# Altium schematic sheet 22_LMS2_TX_BB_DACs.SchDoc: LMS2 TX BB DACs
size A3; Organization: Lime Microsystems; Address1: Surrey Tech Centre; Address2: Guildford GU2 7YG; Address3: Surrey; Address4: United Kingdom; Revision: v1.1; SheetNumber: 22; SheetTotal: 31
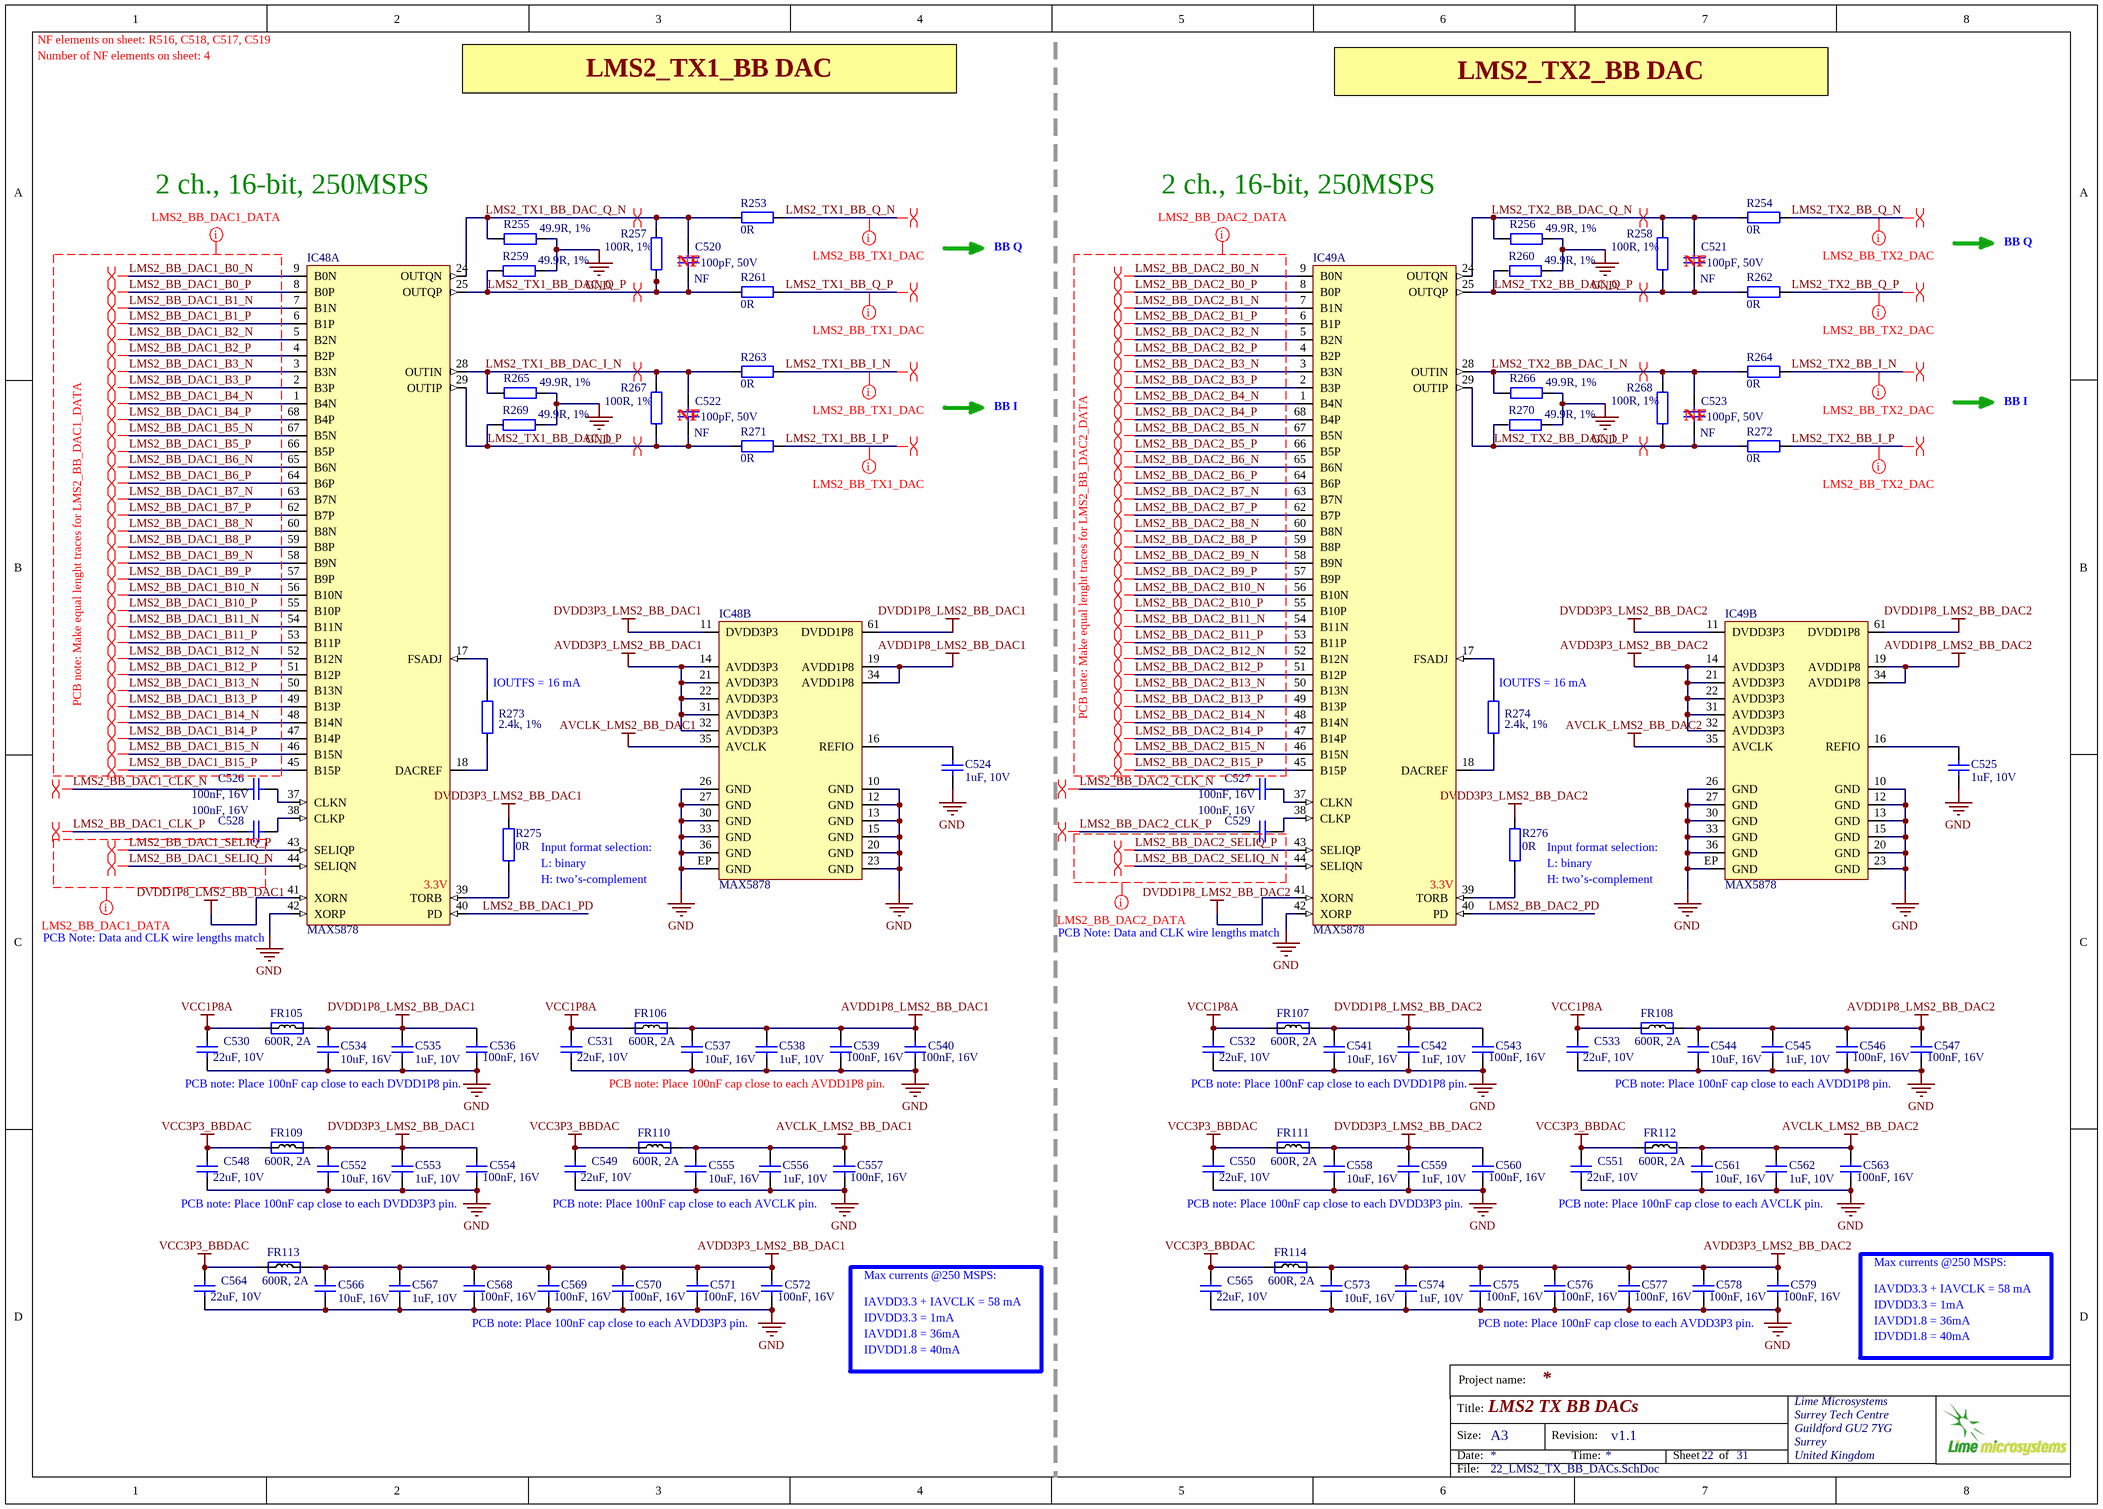
[diagram p0: 22_LMS2_TX_BB_DACs.SchDoc]

## Parts
C520  100pF, 50V  Assembly Info: NF  [CAP0402]
C521  100pF, 50V  Assembly Info: NF  [CAP0402]
C522  100pF, 50V  Assembly Info: NF  [CAP0402]
C523  100pF, 50V  Assembly Info: NF  [CAP0402]
C524  1uF, 10V  [CAP0402]
C525  1uF, 10V  [CAP0402]
C526  100nF, 16V  [CAP0402]
C527  100nF, 16V  [CAP0402]
C528  100nF, 16V  [CAP0402]
C529  100nF, 16V  [CAP0402]
C530  22uF, 10V  [CAP0603]
C531  22uF, 10V  [CAP0603]
C532  22uF, 10V  [CAP0603]
C533  22uF, 10V  [CAP0603]
C534  10uF, 16V  [CAP0603]
C535  1uF, 10V  [CAP0402]
C536  100nF, 16V  [CAP0402]
C537  10uF, 16V  [CAP0603]
C538  1uF, 10V  [CAP0402]
C539  100nF, 16V  [CAP0402]
C540  100nF, 16V  [CAP0402]
C541  10uF, 16V  [CAP0603]
C542  1uF, 10V  [CAP0402]
C543  100nF, 16V  [CAP0402]
C544  10uF, 16V  [CAP0603]
C545  1uF, 10V  [CAP0402]
C546  100nF, 16V  [CAP0402]
C547  100nF, 16V  [CAP0402]
C548  22uF, 10V  [CAP0603]
C549  22uF, 10V  [CAP0603]
C550  22uF, 10V  [CAP0603]
C551  22uF, 10V  [CAP0603]
C552  10uF, 16V  [CAP0603]
C553  1uF, 10V  [CAP0402]
C554  100nF, 16V  [CAP0402]
C555  10uF, 16V  [CAP0603]
C556  1uF, 10V  [CAP0402]
C557  100nF, 16V  [CAP0402]
C558  10uF, 16V  [CAP0603]
C559  1uF, 10V  [CAP0402]
C560  100nF, 16V  [CAP0402]
C561  10uF, 16V  [CAP0603]
C562  1uF, 10V  [CAP0402]
C563  100nF, 16V  [CAP0402]
C564  22uF, 10V  [CAP0603]
C565  22uF, 10V  [CAP0603]
C566  10uF, 16V  [CAP0603]
C567  1uF, 10V  [CAP0402]
C568  100nF, 16V  [CAP0402]
C569  100nF, 16V  [CAP0402]
C570  100nF, 16V  [CAP0402]
C571  100nF, 16V  [CAP0402]
C572  100nF, 16V  [CAP0402]
C573  10uF, 16V  [CAP0603]
C574  1uF, 10V  [CAP0402]
C575  100nF, 16V  [CAP0402]
C576  100nF, 16V  [CAP0402]
C577  100nF, 16V  [CAP0402]
C578  100nF, 16V  [CAP0402]
C579  100nF, 16V  [CAP0402]
FR105  600R, 2A  [RES0805]
FR106  600R, 2A  [RES0805]
FR107  600R, 2A  [RES0805]
FR108  600R, 2A  [RES0805]
FR109  600R, 2A  [RES0805]
FR110  600R, 2A  [RES0805]
FR111  600R, 2A  [RES0805]
FR112  600R, 2A  [RES0805]
FR113  600R, 2A  [RES0805]
FR114  600R, 2A  [RES0805]
IC48  MAX5878  [MAX5878_QFN68]  (parts A,B of 2)
IC49  MAX5878  [MAX5878_QFN68]  (parts A,B of 2)
R253  0R  [RES0402]
R254  0R  [RES0402]
R255  49.9R, 1%  [RES0402]
R256  49.9R, 1%  [RES0402]
R257  100R, 1%  [RES0402]
R258  100R, 1%  [RES0402]
R259  49.9R, 1%  [RES0402]
R260  49.9R, 1%  [RES0402]
R261  0R  [RES0402]
R262  0R  [RES0402]
R263  0R  [RES0402]
R264  0R  [RES0402]
R265  49.9R, 1%  [RES0402]
R266  49.9R, 1%  [RES0402]
R267  100R, 1%  [RES0402]
R268  100R, 1%  [RES0402]
R269  49.9R, 1%  [RES0402]
R270  49.9R, 1%  [RES0402]
R271  0R  [RES0402]
R272  0R  [RES0402]
R273  2.4k, 1%  [RES0402]
R274  2.4k, 1%  [RES0402]
R275  0R  [RES0402]
R276  0R  [RES0402]

## Nets
AVCLK_LMS2_BB_DAC1: C555.2 C556.2 C557.2 FR110.2 IC48.35(AVCLK)
AVCLK_LMS2_BB_DAC2: C561.2 C562.2 C563.2 FR112.2 IC49.35(AVCLK)
AVDD1P8_LMS2_BB_DAC1: C537.2 C538.2 C539.2 C540.2 FR106.2 IC48.19(AVDD1P8) IC48.34(AVDD1P8)
AVDD1P8_LMS2_BB_DAC2: C544.2 C545.2 C546.2 C547.2 FR108.2 IC49.19(AVDD1P8) IC49.34(AVDD1P8)
AVDD3P3_LMS2_BB_DAC1: C566.2 C567.2 C568.2 C569.2 C570.2 C571.2 C572.2 FR113.2 IC48.14(AVDD3P3) IC48.21(AVDD3P3) IC48.22(AVDD3P3) IC48.31(AVDD3P3) IC48.32(AVDD3P3)
AVDD3P3_LMS2_BB_DAC2: C573.2 C574.2 C575.2 C576.2 C577.2 C578.2 C579.2 FR114.2 IC49.14(AVDD3P3) IC49.21(AVDD3P3) IC49.22(AVDD3P3) IC49.31(AVDD3P3) IC49.32(AVDD3P3)
DVDD1P8_LMS2_BB_DAC1: C534.2 C535.2 C536.2 FR105.2 IC48.41(XORN) IC48.61(DVDD1P8)
DVDD1P8_LMS2_BB_DAC2: C541.2 C542.2 C543.2 FR107.2 IC49.41(XORN) IC49.61(DVDD1P8)
DVDD3P3_LMS2_BB_DAC1: C552.2 C553.2 C554.2 FR109.2 IC48.11(DVDD3P3) R275.2
DVDD3P3_LMS2_BB_DAC2: C558.2 C559.2 C560.2 FR111.2 IC49.11(DVDD3P3) R276.2
GND: C524.1 C525.1 C530.1 C531.1 C532.1 C533.1 C534.1 C535.1 C536.1 C537.1 C538.1 C539.1 C540.1 C541.1 C542.1 C543.1 C544.1 C545.1 C546.1 C547.1 C548.1 C549.1 C550.1 C551.1 C552.1 C553.1 C554.1 C555.1 C556.1 C557.1 C558.1 C559.1 C560.1 C561.1 C562.1 C563.1 C564.1 C565.1 C566.1 C567.1 C568.1 C569.1 C570.1 C571.1 C572.1 C573.1 C574.1 C575.1 C576.1 C577.1 C578.1 C579.1 IC48.10(GND) IC48.12(GND) IC48.13(GND) IC48.15(GND) IC48.20(GND) IC48.23(GND) IC48.26(GND) IC48.27(GND) IC48.30(GND) IC48.33(GND) IC48.36(GND) IC48.42(XORP) IC48.EP(GND) IC49.10(GND) IC49.12(GND) IC49.13(GND) IC49.15(GND) IC49.20(GND) IC49.23(GND) IC49.26(GND) IC49.27(GND) IC49.30(GND) IC49.33(GND) IC49.36(GND) IC49.42(XORP) IC49.EP(GND) R255.1 R256.1 R259.1 R260.1 R265.1 R266.1 R269.1 R270.1
VCC1P8A: C530.2 C531.2 C532.2 C533.2 FR105.1 FR106.1 FR107.1 FR108.1
VCC3P3_BBDAC: C548.2 C549.2 C550.2 C551.2 C564.2 C565.2 FR109.1 FR110.1 FR111.1 FR112.1 FR113.1 FR114.1
LMS2_BB_DAC1_B0_N: IC48.9(B0N)
LMS2_BB_DAC1_B0_P: IC48.8(B0P)
LMS2_BB_DAC1_B1_N: IC48.7(B1N)
LMS2_BB_DAC1_B1_P: IC48.6(B1P)
LMS2_BB_DAC1_B2_N: IC48.5(B2N)
LMS2_BB_DAC1_B2_P: IC48.4(B2P)
LMS2_BB_DAC1_B3_N: IC48.3(B3N)
LMS2_BB_DAC1_B3_P: IC48.2(B3P)
LMS2_BB_DAC1_B4_N: IC48.1(B4N)
LMS2_BB_DAC1_B4_P: IC48.68(B4P)
LMS2_BB_DAC1_B5_N: IC48.67(B5N)
LMS2_BB_DAC1_B5_P: IC48.66(B5P)
LMS2_BB_DAC1_B6_N: IC48.65(B6N)
LMS2_BB_DAC1_B6_P: IC48.64(B6P)
LMS2_BB_DAC1_B7_N: IC48.63(B7N)
LMS2_BB_DAC1_B7_P: IC48.62(B7P)
LMS2_BB_DAC1_B8_N: IC48.60(B8N)
LMS2_BB_DAC1_B8_P: IC48.59(B8P)
LMS2_BB_DAC1_B9_N: IC48.58(B9N)
LMS2_BB_DAC1_B9_P: IC48.57(B9P)
LMS2_BB_DAC1_B10_N: IC48.56(B10N)
LMS2_BB_DAC1_B10_P: IC48.55(B10P)
LMS2_BB_DAC1_B11_N: IC48.54(B11N)
LMS2_BB_DAC1_B11_P: IC48.53(B11P)
LMS2_BB_DAC1_B12_N: IC48.52(B12N)
LMS2_BB_DAC1_B12_P: IC48.51(B12P)
LMS2_BB_DAC1_B13_N: IC48.50(B13N)
LMS2_BB_DAC1_B13_P: IC48.49(B13P)
LMS2_BB_DAC1_B14_N: IC48.48(B14N)
LMS2_BB_DAC1_B14_P: IC48.47(B14P)
LMS2_BB_DAC1_B15_N: IC48.46(B15N)
LMS2_BB_DAC1_B15_P: IC48.45(B15P)
LMS2_BB_DAC1_CLK_N: C526.2
LMS2_BB_DAC1_CLK_P: C528.2
LMS2_BB_DAC1_PD: IC48.40(PD)
LMS2_BB_DAC1_SELIQ_N: IC48.44(SELIQN)
LMS2_BB_DAC1_SELIQ_P: IC48.43(SELIQP)
LMS2_BB_DAC2_B0_N: IC49.9(B0N)
LMS2_BB_DAC2_B0_P: IC49.8(B0P)
LMS2_BB_DAC2_B1_N: IC49.7(B1N)
LMS2_BB_DAC2_B1_P: IC49.6(B1P)
LMS2_BB_DAC2_B2_N: IC49.5(B2N)
LMS2_BB_DAC2_B2_P: IC49.4(B2P)
LMS2_BB_DAC2_B3_N: IC49.3(B3N)
LMS2_BB_DAC2_B3_P: IC49.2(B3P)
LMS2_BB_DAC2_B4_N: IC49.1(B4N)
LMS2_BB_DAC2_B4_P: IC49.68(B4P)
LMS2_BB_DAC2_B5_N: IC49.67(B5N)
LMS2_BB_DAC2_B5_P: IC49.66(B5P)
LMS2_BB_DAC2_B6_N: IC49.65(B6N)
LMS2_BB_DAC2_B6_P: IC49.64(B6P)
LMS2_BB_DAC2_B7_N: IC49.63(B7N)
LMS2_BB_DAC2_B7_P: IC49.62(B7P)
LMS2_BB_DAC2_B8_N: IC49.60(B8N)
LMS2_BB_DAC2_B8_P: IC49.59(B8P)
LMS2_BB_DAC2_B9_N: IC49.58(B9N)
LMS2_BB_DAC2_B9_P: IC49.57(B9P)
LMS2_BB_DAC2_B10_N: IC49.56(B10N)
LMS2_BB_DAC2_B10_P: IC49.55(B10P)
LMS2_BB_DAC2_B11_N: IC49.54(B11N)
LMS2_BB_DAC2_B11_P: IC49.53(B11P)
LMS2_BB_DAC2_B12_N: IC49.52(B12N)
LMS2_BB_DAC2_B12_P: IC49.51(B12P)
LMS2_BB_DAC2_B13_N: IC49.50(B13N)
LMS2_BB_DAC2_B13_P: IC49.49(B13P)
LMS2_BB_DAC2_B14_N: IC49.48(B14N)
LMS2_BB_DAC2_B14_P: IC49.47(B14P)
LMS2_BB_DAC2_B15_N: IC49.46(B15N)
LMS2_BB_DAC2_B15_P: IC49.45(B15P)
LMS2_BB_DAC2_CLK_N: C527.2
LMS2_BB_DAC2_CLK_P: C529.2
LMS2_BB_DAC2_PD: IC49.40(PD)
LMS2_BB_DAC2_SELIQ_N: IC49.44(SELIQN)
LMS2_BB_DAC2_SELIQ_P: IC49.43(SELIQP)
LMS2_TX1_BB_DAC_I_N: C522.1 IC48.28(OUTIN) R263.1 R265.2 R267.1
LMS2_TX1_BB_DAC_I_P: C522.2 IC48.29(OUTIP) R267.2 R269.2 R271.1
LMS2_TX1_BB_DAC_Q_N: C520.1 IC48.24(OUTQN) R253.1 R255.2 R257.1
LMS2_TX1_BB_DAC_Q_P: C520.2 IC48.25(OUTQP) R257.2 R259.2 R261.1
LMS2_TX1_BB_I_N: R263.2
LMS2_TX1_BB_I_P: R271.2
LMS2_TX1_BB_Q_N: R253.2
LMS2_TX1_BB_Q_P: R261.2
LMS2_TX2_BB_DAC_I_N: C523.1 IC49.28(OUTIN) R264.1 R266.2 R268.1
LMS2_TX2_BB_DAC_I_P: C523.2 IC49.29(OUTIP) R268.2 R270.2 R272.1
LMS2_TX2_BB_DAC_Q_N: C521.1 IC49.24(OUTQN) R254.1 R256.2 R258.1
LMS2_TX2_BB_DAC_Q_P: C521.2 IC49.25(OUTQP) R258.2 R260.2 R262.1
LMS2_TX2_BB_I_N: R264.2
LMS2_TX2_BB_I_P: R272.2
LMS2_TX2_BB_Q_N: R254.2
LMS2_TX2_BB_Q_P: R262.2
NetC524_2: C524.2 IC48.16(REFIO)
NetC525_2: C525.2 IC49.16(REFIO)
NetC526_1: C526.1 IC48.37(CLKN)
NetC527_1: C527.1 IC49.37(CLKN)
NetC528_1: C528.1 IC48.38(CLKP)
NetC529_1: C529.1 IC49.38(CLKP)
NetIC48_17: IC48.17(FSADJ) R273.2
NetIC48_18: IC48.18(DACREF) R273.1
NetIC48_39: IC48.39(TORB) R275.1
NetIC49_17: IC49.17(FSADJ) R274.2
NetIC49_18: IC49.18(DACREF) R274.1
NetIC49_39: IC49.39(TORB) R276.1

## Layout directives
differential pair: LMS2_BB_DAC1_B0_N, LMS2_BB_DAC1_B0_P, LMS2_BB_DAC1_B1_N, LMS2_BB_DAC1_B1_P, LMS2_BB_DAC1_B2_N, LMS2_BB_DAC1_B2_P, LMS2_BB_DAC1_B3_N, LMS2_BB_DAC1_B3_P, LMS2_BB_DAC1_B4_N, LMS2_BB_DAC1_B4_P, LMS2_BB_DAC1_B5_N, LMS2_BB_DAC1_B5_P, LMS2_BB_DAC1_B6_N, LMS2_BB_DAC1_B6_P, LMS2_BB_DAC1_B7_N, LMS2_BB_DAC1_B7_P, LMS2_BB_DAC1_B8_N, LMS2_BB_DAC1_B8_P, LMS2_BB_DAC1_B9_N, LMS2_BB_DAC1_B9_P, LMS2_BB_DAC1_B10_N, LMS2_BB_DAC1_B10_P, LMS2_BB_DAC1_B11_N, LMS2_BB_DAC1_B11_P, LMS2_BB_DAC1_B12_N, LMS2_BB_DAC1_B12_P, LMS2_BB_DAC1_B13_N, LMS2_BB_DAC1_B13_P, LMS2_BB_DAC1_B14_N, LMS2_BB_DAC1_B14_P, LMS2_BB_DAC1_B15_N, LMS2_BB_DAC1_B15_P, LMS2_BB_DAC1_CLK_N, LMS2_BB_DAC1_CLK_P, LMS2_BB_DAC1_SELIQ_N, LMS2_BB_DAC1_SELIQ_P, LMS2_BB_DAC2_B0_N, LMS2_BB_DAC2_B0_P, LMS2_BB_DAC2_B1_N, LMS2_BB_DAC2_B1_P, LMS2_BB_DAC2_B2_N, LMS2_BB_DAC2_B2_P, LMS2_BB_DAC2_B3_N, LMS2_BB_DAC2_B3_P, LMS2_BB_DAC2_B4_N, LMS2_BB_DAC2_B4_P, LMS2_BB_DAC2_B5_N, LMS2_BB_DAC2_B5_P, LMS2_BB_DAC2_B6_N, LMS2_BB_DAC2_B6_P, LMS2_BB_DAC2_B7_N, LMS2_BB_DAC2_B7_P, LMS2_BB_DAC2_B8_N, LMS2_BB_DAC2_B8_P, LMS2_BB_DAC2_B9_N, LMS2_BB_DAC2_B9_P, LMS2_BB_DAC2_B10_N, LMS2_BB_DAC2_B10_P, LMS2_BB_DAC2_B11_N, LMS2_BB_DAC2_B11_P, LMS2_BB_DAC2_B12_N, LMS2_BB_DAC2_B12_P, LMS2_BB_DAC2_B13_N, LMS2_BB_DAC2_B13_P, LMS2_BB_DAC2_B14_N, LMS2_BB_DAC2_B14_P, LMS2_BB_DAC2_B15_N, LMS2_BB_DAC2_B15_P, LMS2_BB_DAC2_CLK_N, LMS2_BB_DAC2_CLK_P, LMS2_BB_DAC2_SELIQ_N, LMS2_BB_DAC2_SELIQ_P, LMS2_TX1_BB_DAC_I_N, LMS2_TX1_BB_DAC_I_P, LMS2_TX1_BB_DAC_Q_N, LMS2_TX1_BB_DAC_Q_P, LMS2_TX1_BB_I_N, LMS2_TX1_BB_I_P, LMS2_TX1_BB_Q_N, LMS2_TX1_BB_Q_P, LMS2_TX2_BB_DAC_I_N, LMS2_TX2_BB_DAC_I_P, LMS2_TX2_BB_DAC_Q_N, LMS2_TX2_BB_DAC_Q_P, LMS2_TX2_BB_I_N, LMS2_TX2_BB_I_P, LMS2_TX2_BB_Q_N, LMS2_TX2_BB_Q_P
net class LMS2_BB_DAC1_DATA: LMS2_BB_DAC1_B0_N, LMS2_BB_DAC1_B0_P, LMS2_BB_DAC1_B1_N, LMS2_BB_DAC1_B1_P, LMS2_BB_DAC1_B2_N, LMS2_BB_DAC1_B2_P, LMS2_BB_DAC1_B3_N, LMS2_BB_DAC1_B3_P, LMS2_BB_DAC1_B4_N, LMS2_BB_DAC1_B4_P, LMS2_BB_DAC1_B5_N, LMS2_BB_DAC1_B5_P, LMS2_BB_DAC1_B6_N, LMS2_BB_DAC1_B6_P, LMS2_BB_DAC1_B7_N, LMS2_BB_DAC1_B7_P, LMS2_BB_DAC1_B8_N, LMS2_BB_DAC1_B8_P, LMS2_BB_DAC1_B9_N, LMS2_BB_DAC1_B9_P, LMS2_BB_DAC1_B10_N, LMS2_BB_DAC1_B10_P, LMS2_BB_DAC1_B11_N, LMS2_BB_DAC1_B11_P, LMS2_BB_DAC1_B12_N, LMS2_BB_DAC1_B12_P, LMS2_BB_DAC1_B13_N, LMS2_BB_DAC1_B13_P, LMS2_BB_DAC1_B14_N, LMS2_BB_DAC1_B14_P, LMS2_BB_DAC1_B15_N, LMS2_BB_DAC1_B15_P, LMS2_BB_DAC1_SELIQ_N, LMS2_BB_DAC1_SELIQ_P
net class LMS2_BB_DAC2_DATA: LMS2_BB_DAC2_B0_N, LMS2_BB_DAC2_B0_P, LMS2_BB_DAC2_B1_N, LMS2_BB_DAC2_B1_P, LMS2_BB_DAC2_B2_N, LMS2_BB_DAC2_B2_P, LMS2_BB_DAC2_B3_N, LMS2_BB_DAC2_B3_P, LMS2_BB_DAC2_B4_N, LMS2_BB_DAC2_B4_P, LMS2_BB_DAC2_B5_N, LMS2_BB_DAC2_B5_P, LMS2_BB_DAC2_B6_N, LMS2_BB_DAC2_B6_P, LMS2_BB_DAC2_B7_N, LMS2_BB_DAC2_B7_P, LMS2_BB_DAC2_B8_N, LMS2_BB_DAC2_B8_P, LMS2_BB_DAC2_B9_N, LMS2_BB_DAC2_B9_P, LMS2_BB_DAC2_B10_N, LMS2_BB_DAC2_B10_P, LMS2_BB_DAC2_B11_N, LMS2_BB_DAC2_B11_P, LMS2_BB_DAC2_B12_N, LMS2_BB_DAC2_B12_P, LMS2_BB_DAC2_B13_N, LMS2_BB_DAC2_B13_P, LMS2_BB_DAC2_B14_N, LMS2_BB_DAC2_B14_P, LMS2_BB_DAC2_B15_N, LMS2_BB_DAC2_B15_P, LMS2_BB_DAC2_SELIQ_N, LMS2_BB_DAC2_SELIQ_P
net class LMS2_BB_TX2_DAC: LMS2_TX2_BB_I_N, LMS2_TX2_BB_I_P, LMS2_TX2_BB_Q_N, LMS2_TX2_BB_Q_P
net class LMS2_BB_TX1_DAC: LMS2_TX1_BB_I_N, LMS2_TX1_BB_I_P, LMS2_TX1_BB_Q_N, LMS2_TX1_BB_Q_P

## Notes on the sheet
- NF elements on sheet: R516, C518, C517, C519
- Number of NF elements on sheet: 4
- LMS2_TX1_BB DAC
- LMS2_TX2_BB DAC
- (near R255) 2 ch., 16-bit, 250MSPS
- BB Q
- (near R256) 2 ch., 16-bit, 250MSPS
- (near C520) NF
- (near C521) NF
- (near C522) NF
- BB I
- (near C523) NF
- PCB note: Make equal lenght traces for LMS2_BB_DAC1_DATA
- (near R273) IOUTFS = 16 mA
- PCB note: Make equal lenght traces for LMS2_BB_DAC2_DATA
- (near R274) IOUTFS = 16 mA
- Input format selection:
- (near IC48) 3.3V
- (near R275) L: binary
- (near R275) H: two’s-complement
- (near IC49) 3.3V
- (near R276) L: binary
- (near R276) H: two’s-complement
- (near IC48) PCB Note: Data and CLK wire lengths match
- (near IC49) PCB Note: Data and CLK wire lengths match
- PCB note: Place 100nF cap close to each DVDD1P8 pin.
- PCB note: Place 100nF cap close to each AVDD1P8 pin.
- PCB note: Place 100nF cap close to each DVDD3P3 pin.
- PCB note: Place 100nF cap close to each AVCLK pin.
- PCB note: Place 100nF cap close to each AVDD3P3 pin.
- IAVDD3.3 + IAVCLK = 58 mA
- IDVDD3.3 = 1mA
- Max currents @250 MSPS:
- IAVDD1.8 = 36mA
- IDVDD1.8 = 40mA
- Project name:
- Title:
- Size:
- Date:
- A3
- Revision:
- Time:
- Sheet
- of
- File:

## Library data of the parts
C520-C523 = Cap_0402: Manufacturer Part Number 1: CC0402JRNPO9BN101; Manufacturer: Yageo; Part Description: 100pF ±5% 50V C0G, NP0 Ceramic Capacitor -55°C ~ 125°C Surface Mount, MLCC 0402 (1005 Metric) 0.039" L x 0.020" W (1.00mm x 0.50mm); Tolerance: ±5%; Temperature Coefficient: C0G, NP0; Value: 100pF, 50V; Capacitance: 100pF; Thickness (Max): 0.022" (0.55mm); Size / Dimension: 0.039" L x 0.020" W (1.00mm x 0.50mm); RoHS: RoHS Compliant; Ratings: -; Package / Case: 0402 (1005 Metric); Mounting Type: Surface Mount, MLCC; Height - Seated (Max): -; Features: -; Lead Spacing: -; Voltage - Rated: 50V; Operating Temperature: -55°C ~ 125°C; Packaging: Cut Tape (CT); Applications: General Purpose; Lead Style: -; Supplier 1: Digi-Key; Category: Capacitors; Supplier Part Number 1: 311-1024-1-ND
C524 C525 C535 C538 C542 C545 C553 C556 C559 C562 C567 C574 = Cap_0402: Manufacturer Part Number 1: C1005X5R1E105K050BC; Manufacturer: TDK; Part Description: 1µF ±10% 10V X5R Ceramic Capacitor -55°C ~ 85°C Surface Mount, MLCC 0402 (1005 Metric) 0.039" L x 0.020" W (1.00mm x 0.50mm); Voltage Rating: 10; Capacitance Tolerance: ± 10%; Product Range: TDK - C Series; Ceramic Capacitor Case: 0402 [1005 Metric]; Capacitance: 1; Dielectric Characteristic: X6; Value: 1uF, 10V; Supplier 1: Digi-Key; Supplier Part Number 1: 445-9066-1-ND; MSL: -; RoHS: YES
C526-C529 C536 C539 C540 C543 C546 C547 C554 C557 C560 C563 C568-C572 C575-C579 = Cap_0603: Part Description: 0.10µF ±10% 16V X7R Ceramic Capacitor -55°C ~ 125°C Surface Mount, MLCC 0402 (1005 Metric) 0.039" L x 0.020" W (1.00mm x 0.50mm); Manufacturer Part Number 1: GRM155R71C104KA88D; Brand: Murata Electronics; Tolerance: 10 %; Type: General Purpose MLCC; Capacitance: 0.1 uF; Temperature Coefficient / Code: +/- 15 %; Case Height: 0.5 mm; Case Length: 1 mm; Dielectric: X7R; Supplier 1: Mouser; Supplier Part Number 1: 81-GRM155R71C104KA88; Case Code - in: 0402; Manufacturer: Murata Electronics; Category: Multilayer Ceramic Capacitors MLCC - SMD/SMT; Voltage Rating DC: 16 V; Value: 100nF, 16V; Case Code - mm: 1005; Case Width: 0.5 mm; Maximum Operating Temperature: + 125 C; Minimum Operating Temperature: - 55 C; Minimum Order Quantity: 1; Operating Temperature Range: - 55 C to + 125 C; Package / Case: 0402 (1005 metric); Packaging: Reel; Product: General Type MLCCs; Product Category: Low & Medium Capacitance SMD Ceramic Chip Capacitors; Reeling: True; RoHS - Mouser: Y; RoHS: RoHS Compliant; Series: GRM; Standard Pack Qty: 10000; Termination Style: SMD/SMT
C530-C533 C548-C551 C564 C565 = Cap_0603: Manufacturer Part Number 1: C1608X5R1A226M080AC; Part Description: 22µF ±20% 10V Ceramic Capacitor X5R 0603 (1608 Metric); Manufacturer: TDK Corporation; Brand: TDK; Temperature Coefficient / Code: +/- 15 %; Tolerance: 20 %; Type: Multilayer Ceramic Chip Capacitor; Supplier 1: Mouser; Supplier Part Number 1: 810-C1608X5R1A226M; Package / Case: 0603 (1608 metric); Category: Multilayer Ceramic Capacitors MLCC - SMD/SMT; Capacitance: 22 uF; Operating Temperature Range: - 55 C to + 85 C; Case Code - in: 0603; Voltage Rating DC: 10 V; Case Code - mm: 1608; Value: 22uF, 10V
C534 C537 C541 C544 C552 C555 C558 C561 C566 C573 = Cap_0603: Manufacturer: Yageo; Manufacturer Part Number 1: GRM188R61C106MA73D; Part Description: 10µF ±20% 16V Ceramic Capacitor X5R 0603 (1608 Metric); Temperature Coefficient: X5R; Capacitance: 10µF; Tolerance: ±20%; Value: 10uF, 16V; Supplier 1: Digi-Key; Supplier Part Number 1: 490-7201-2-ND; Category: Capacitors; Ratings: -; Features: -; Lead Style: -; Package / Case: 0603 (1608 Metric); Lead Spacing: -; Applications: General Purpose; Voltage - Rated: 16V; Operating Temperature: -55°C ~ 85°C; Thickness (Max): 0.039" (1.00mm); Mounting Type: Surface Mount, MLCC; RoHS: RoHS Compliant; Size / Dimension: 0.063" L x 0.031" W (1.60mm x 0.80mm); Packaging: Tape & Reel (TR); Height - Seated (Max): -
FR105-FR114 = Ferrite: Manufacturer Part Number 1: MPZ2012S601AT000; Manufacturer: TDK Corporation; Part Description: FERRITE BEAD 600 OHM 0805 1LN; Filter Type: Differential Mode - Single; Impedance @ Frequency: 600 Ohm @ 100MHz; DC Resistance (DCR): 100 mOhm Max; Supplier 1: Digi-Key; Supplier Part Number 1: 445-2206-2-ND; Mounting Type: Surface Mount; RoHS: RoHS Compliant; Height (Max): 0.041" (1.05mm); Packaging: Tape & Reel (TR); Category: Filters; Current Rating: 2A; Package / Case: 0805 (2012 Metric); Size / Dimension: 0.079" L x 0.049" W (2.00mm x 1.25mm); Value: 600R, 2A
IC48 IC49 = MAX5878EGK: Part Description: 16 Bit Digital to Analog Converter 2 68-QFN-EP (10x10); Manufacturer: Maxim; Manufacturer Part Number 1: MAX5878EGK+D; Max Power Dissipation: 331mW; Number of DAC Channels: 2; Max Supply Voltage: 3.465V; Min Supply Voltage: 3.135V; Interface: Parallel,LVDS; Settling Time: 14ns; Number of Bits: 16; Sampling Rate: 250000000S/s; Resolution: 16b; Supply Type: Analog,Digital; Conversion Rate: 250MS/s; Integral Nonlinearity (INL): 3LSB; Supplier 1: Digi-Key; Supplier Part Number 1: MAX5878EGK+D-ND; Stock 1: 52; Pricing 1: 1=23,84000, 10=21,99000, 25=21,00200, 100=20,44800 (USD); RoHS: Yes; Mount: Surface Mount; Case/Package: QFN; Number of Pins: 68; Min Operating Temperature: -40°C; Max Operating Temperature: 85°C; Packaging: Rail/Tube; Package Quantity: 30; Number of Converters: 2; Radiation Hardening: No; REACH SVHC: Unknown; ComponentLink1URL: https://datasheet.ciiva.com/1399/max5878-1399152.pdf?src-supplier=Digi-Key; ComponentLink1Description: https://datasheet.ciiva.com/1399/max5878-1399152.pdf?src-supplier=Digi-Key; ComponentLink2URL: https://datasheet.ciiva.com/16604/max5878-16604848.pdf?src-supplier=Avnet+Europe; ComponentLink2Description: https://datasheet.ciiva.com/16604/max5878-16604848.pdf?src-supplier=Avnet+Europe; ComponentLink3URL: https://datasheet.ciiva.com/12285/max5878-106739-12285938.pdf?src-supplier=Mouser; ComponentLink3Description: https://datasheet.ciiva.com/12285/max5878-106739-12285938.pdf?src-supplier=Mouser; ComponentLink4URL: https://datasheet.ciiva.com/26805/max5878egk-d-26805730.pdf?src-supplier=IIIC; ComponentLink4Description: https://datasheet.ciiva.com/26805/max5878egk-d-26805730.pdf?src-supplier=IIIC; ComponentLink5URL: https://datasheet.ciiva.com/14250/max5878-14250858.pdf?src-supplier=Avnet; ComponentLink5Description: https://datasheet.ciiva.com/14250/max5878-14250858.pdf?src-supplier=Avnet
R253 R254 R261-R264 R271 R272 R275 R276 = Res_0402: Manufacturer Part Number 1: RC0402JR-070RL; Manufacturer: Yageo; Part Description: RES SMD 0.0OHM JUMPER 1/16W 0402; Resistance (Ohms): 0.0; Tolerance: Jumper; Power (Watts): 0.063W, 1/16W; Value: 0R; Supplier 1: Digi-Key; Supplier Part Number 1: 311-0.0JRTR-ND; Category: Resistors; Temperature Coefficient: -; Features: Moisture Resistant; Supplier Device Package: 0402; Height: 0.016" (0.40mm); Package / Case: 0402 (1005 Metric); Operating Temperature: -55°C ~ 155°C; Size / Dimension: 0.039" L x 0.020" W (1.00mm x 0.50mm); Composition: Thick Film; Packaging: Tape & Reel (TR); Number of Terminations: 2; RoHS: RoHS Compliant
R255 R256 R259 R260 R265 R266 R269 R270 = Res_0402: Manufacturer: Samsung Electro-Mechanics America, Inc.; Part Description: RES SMD 49.9 OHM 1% 1/16W 0402; Manufacturer Part Number 1: RC1005F49R9CS; Temperature Coefficient: ±100ppm/°C; Resistance (Ohms): 49.9; Power (Watts): 0.063W, 1/16W; Number of Terminations: 2; Size / Dimension: 0.039" L x 0.020" W (1.00mm x 0.50mm); Supplier Device Package: 0402 (1005 Metric); RoHS: RoHS Compliant; Supplier Part Number 1: 1276-3469-6-ND; Features: -; Packaging: Digi-Reel®; Tolerance: ±1%; Height: 0.016" (0.40mm); Category: Resistors; Composition: Thick Film; Package / Case: 0402 (1005 Metric); Supplier 1: Digi-Key; Operating Temperature: -55°C ~ 155°C; Value: 49.9R, 1%
R257 R258 R267 R268 = Res_0402: Manufacturer Part Number 1: RMCF0402FT100R; Manufacturer: Stackpole Electronics Inc.; Part Description: RES SMD 100 OHM 1% 1/16W 0402; Power (Watts): 0.063W, 1/16W; Temperature Coefficient: ±100ppm/°C; Resistance (Ohms): 100; Value: 100R, 1%; Supplier 1: Digi-Key; Supplier Part Number 1: RMCF0402FT100RDKR-ND; Packaging: Digi-Reel®; Composition: Thick Film; Number of Terminations: 2; Package / Case: 0402 (1005 Metric); RoHS: RoHS Compliant; Category: Resistors; Size / Dimension: 0.039" L x 0.020" W (1.00mm x 0.50mm); Tolerance: ±1%; Supplier Device Package: 0402; Features: -; Height: 0.016" (0.40mm); Operating Temperature: -55°C ~ 155°C
R273 R274 = Res_0402: Manufacturer Part Number 1: RC0402FR-072K4L; Manufacturer: Yageo; Part Description: 2.4 kOhms ±1% 0.063W, 1/16W Chip Resistor 0402 (1005 Metric) Moisture Resistant Thick Film; Temperature Coefficient: ±100ppm/°C; Power (Watts): 0.063W, 1/16W; Value: 2.4k, 1%; Package / Case: 0402 (1005 Metric); RoHS: RoHS Compliant; Supplier Part Number 1: 311-2.40KLRCT-ND; Resistance (Ohms): 2.4k; Size / Dimension: 0.039" L x 0.020" W (1.00mm x 0.50mm); Category: Resistors; Part Status: Active; Features: Moisture Resistant; Supplier Device Package: 0402; Failure Rate: -; Tolerance: ±1%; Composition: Thick Film; Packaging: Cut Tape (CT); Operating Temperature: -55°C ~ 155°C; Height - Seated (Max): 0.016" (0.40mm); Supplier 1: Digi-Key